# Altium schematic sheet Radio.SchDoc
size A4
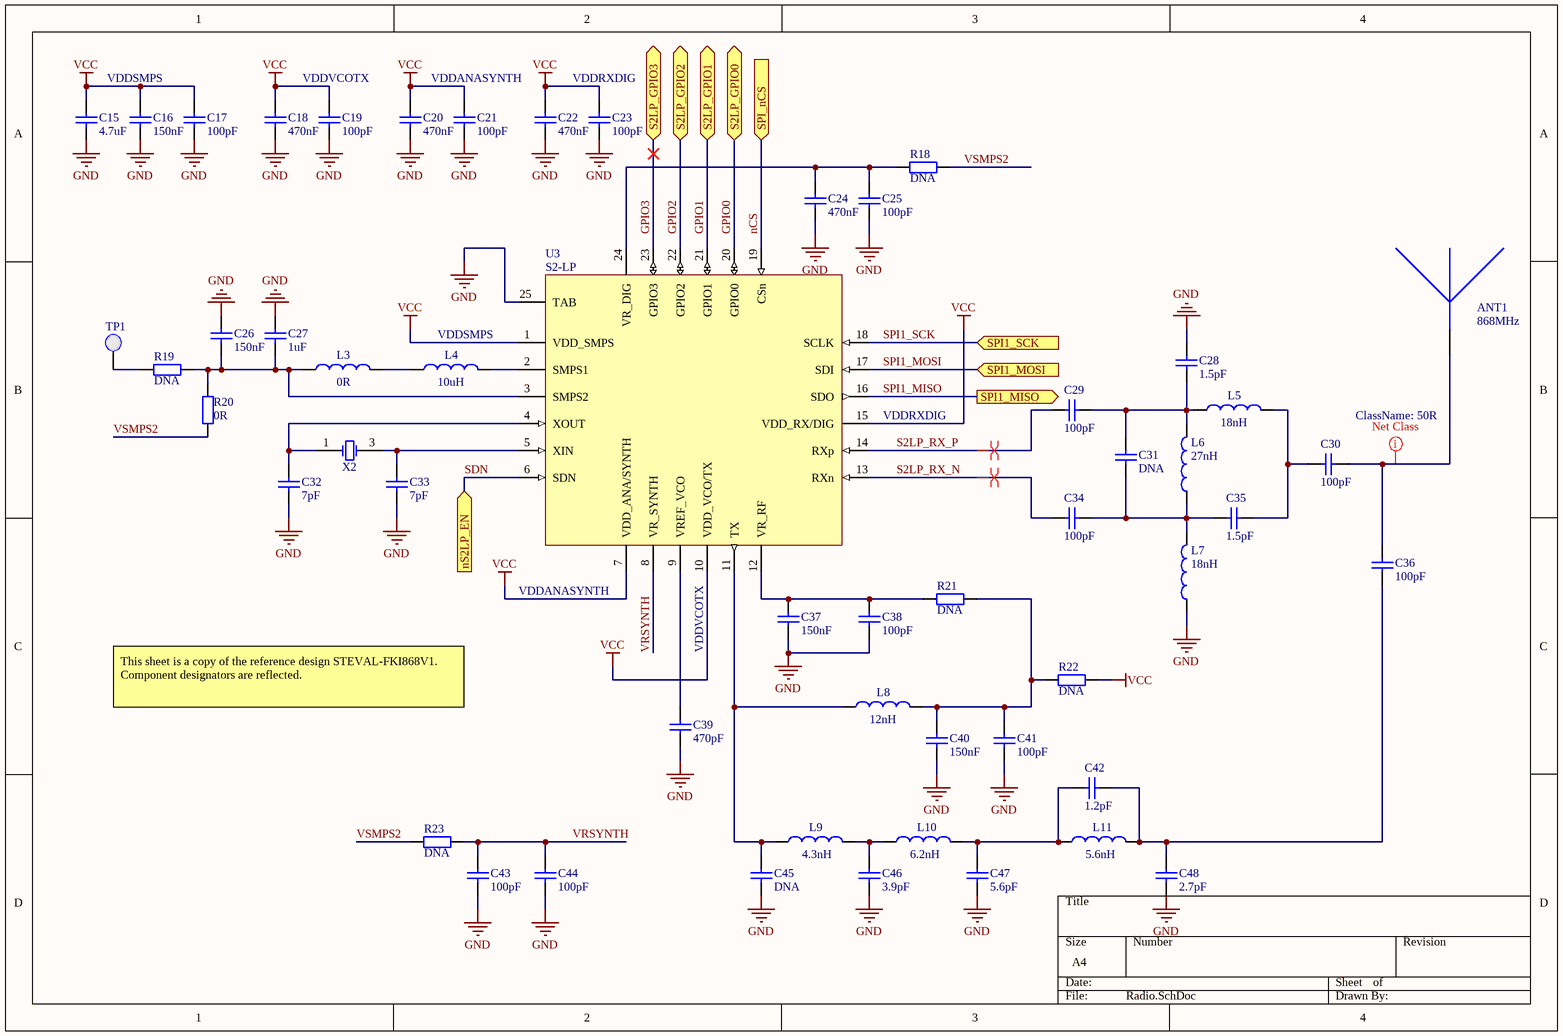
[diagram p0: Radio.SchDoc]

## Parts
ANT1  868MHz  [ANTENNA]
C15  4.7uF  [C0603]
C16  150nF  [C0402]
C17  100pF  [C0402]
C18  470nF  [C0402]
C19  100pF  [C0402]
C20  470nF  [C0402]
C21  100pF  [C0402]
C22  470nF  [C0402]
C23  100pF  [C0402]
C24  470nF  [C0402]
C25  100pF  [C0402]
C26  150nF  [C0402]
C27  1uF  [C0603]
C28  1.5pF  [C0402]
C29  100pF  [C0402]
C30  100pF  [C0402]
C31  DNA
C32  7pF  [C0805]
C33  7pF  [C0805]
C34  100pF  [C0402]
C35  1.5pF  [C0402]
C36  100pF  [C0402]
C37  150nF  [C0402]
C38  100pF  [C0402]
C39  470pF  [C0402]
C40  150nF  [C0402]
C41  100pF  [C0402]
C42  1.2pF  [C0402]
C43  100pF  [C0402]
C44  100pF  [C0402]
C45  DNA  [C0402]
C46  3.9pF  [C0402]
C47  5.6pF  [C0402]
C48  2.7pF  [C0402]
L3  0R  [R0402]
L4  Inductance: 10uH  [R0805]  (hidden comment: IND)
L5  Inductance: 18nH  [R0603]  (hidden comment: IND)
L6  Inductance: 27nH  [R0603]  (hidden comment: IND)
L7  Inductance: 18nH  [R0603]  (hidden comment: IND)
L8  Inductance: 12nH  [R0603]  (hidden comment: IND)
L9  Inductance: 4.3nH  [R0402]  (hidden comment: IND)
L10  Inductance: 6.2nH  [R0402]  (hidden comment: IND)
L11  Inductance: 5.6nH  [R0805]  (hidden comment: IND)
R18  DNA  [R0402]
R19  DNA  [R0402]
R20  0R  [R0402]
R21  DNA  [R0402]
R22  DNA  [R0402]
R23  DNA  [R0402]
TP1  TP_1mm  [TP_1mm]  (value not drawn)  (no BOM)
U3  S2-LP  [ST_S2LP]
X2  50MHz  [ABRACON_ABMM2]  (value not drawn)

## Ports
nS2LP_EN (in), S2LP_GPIO0 (bidir), S2LP_GPIO1 (bidir), S2LP_GPIO2 (bidir), S2LP_GPIO3 (bidir), SPI1_MISO (out), SPI1_MOSI (in), SPI1_SCK (in), SPI_nCS (in)

## Nets
GND: C15.1 C16.1 C17.1 C18.1 C19.1 C20.1 C21.1 C22.1 C23.1 C24.1 C25.1 C26.2 C27.2 C28.1 C32.1 C33.1 C37.1 C38.1 C39.1 C40.1 C41.1 C43.1 C44.1 C45.1 C46.1 C47.1 C48.1 L7.2 U3.25(TAB)
VCC: C15.2 C16.2 C17.2 C18.2 C19.2 C20.2 C21.2 C22.2 C23.2 R22.2 U3.1(VDD_SMPS) U3.7(VDD_ANA/SYNTH) U3.10(VDD_VCO/TX) U3.15(VDD_RX/DIG)
GPIO0: U3.20(GPIO0) ; port S2LP_GPIO0
GPIO1: U3.21(GPIO1) ; port S2LP_GPIO1
GPIO2: U3.22(GPIO2) ; port S2LP_GPIO2
GPIO3: U3.23(GPIO3) ; port S2LP_GPIO3
nCS: U3.19(CSn) ; port SPI_nCS
S2LP_RX_N: C34.2 U3.13(RXn)
S2LP_RX_P: C29.2 U3.14(RXp)
SDN: U3.6(SDN) ; port nS2LP_EN
SPI1_MISO: U3.16(SDO) ; port SPI1_MISO
SPI1_MOSI: U3.17(SDI) ; port SPI1_MOSI
SPI1_SCK: U3.18(SCLK) ; port SPI1_SCK
VRSYNTH: C43.2 C44.2 R23.2 U3.8(VR_SYNTH)
VSMPS2: R18.2 R20.1 R23.1
NetANT1_1: ANT1.1(V+) C30.1 C36.2
NetC24_2: C24.2 C25.2 R18.1 U3.24(VR_DIG)
NetC26_1: C26.1 C27.1 L3.2 R19.2 R20.2 U3.3(SMPS2)
NetC28_2: C28.2 C29.1 C31.2 L5.2 L6.1
NetC30_2: C30.2 C35.1 L5.1
NetC31_1: C31.1 C34.1 C35.2 L6.2 L7.1
NetC32_2: C32.2 U3.4(XOUT) X2.1(OSC1)
NetC33_2: C33.2 U3.5(XIN) X2.3(OSC2)
NetC36_1: C36.1 C42.1 C48.2 L11.1
NetC37_2: C37.2 C38.2 R21.1 U3.12(VR_RF)
NetC39_2: C39.2 U3.9(VREF_VCO)
NetC40_2: C40.2 C41.2 L8.1 R21.2 R22.1
NetC42_2: C42.2 C47.2 L10.1 L11.2
NetC45_2: C45.2 L8.2 L9.2 U3.11(TX)
NetC46_2: C46.2 L9.1 L10.2
NetL3_1: L3.1 L4.2
NetL4_1: L4.1 U3.2(SMPS1)
NetR19_1: R19.1 TP1.1

## Layout directives
net class 50R: NetANT1_1
differential pair: S2LP_RX_N, S2LP_RX_P

## Notes on the sheet
- VDDSMPS
- VDDVCOTX
- VDDANASYNTH
- VDDRXDIG
- (near L4) VDDSMPS
- (near U3) VDDRXDIG
- (near U3) VDDANASYNTH
- This sheet is a copy of the reference design STEVAL-FKI868V1. Component designators are reflected.

## Library data of the parts
ANT1 = ANTENNA
C15 = CAP: Manufacturer: MURATA; Manufacturer Part Number: GRM188R60J475KE19
C16 C26 C37 C40 = CAP: Manufacturer: MURATA; Manufacturer Part Number: GRM155R61A154KE19
C17 C19 C21 C23 C25 C29 C30 C34 C36 C38 C41 C43 C44 = CAP: Manufacturer: MURATA; Manufacturer Part Number: GRM1555C1H101JA01D
C18 C20 C22 C24 = CAP: Manufacturer: MURATA; Manufacturer Part Number: GRM155R61A474KE15
C27 = CAP: Manufacturer: MURATA; Manufacturer Part Number: GRM188R60J105KA01D
C28 C35 = CAP: Manufacturer: MURATA; Manufacturer Part Number: GRM1555C1H1R5CA01D
C31 C45 = CAP
C32 C33 = CAP: Manufacturer: Yageo; Manufacturer Part Number: CC0805DRNPO9BN7R0
C39 = CAP: Manufacturer: Murata; Manufacturer Part Number: GRM1555C1H471JA01
C42 = CAP: Manufacturer: MURATA; Manufacturer Part Number: GRM1555C1H1R2CA01D
C46 = CAP: Manufacturer: MURATA; Manufacturer Part Number: GRM1555C1H3R9CA01D
C47 = CAP: Manufacturer: MURATA; Manufacturer Part Number: GRM1555C1H5R6CA01D
C48 = CAP: Manufacturer: MURATA; Manufacturer Part Number: GRM1555C1H2R7BA01D
L3 = IND: Manufacturer: TE Connectivity; Manufacturer Part Number: CRG0402ZR
L4 = IND: Manufacturer: MURATA; Manufacturer Part Number: LQM21FN100M70L
L5 L7 = IND: Manufacturer: MURATA; Manufacturer Part Number: LQG15HS18NJ02D
L6 = IND: Manufacturer: MURATA; Manufacturer Part Number: LQG15HS27NJ02D
L8 = IND: Manufacturer: MURATA; Manufacturer Part Number: LQG18HN12NJ00D
L9 = IND: Manufacturer: MURATA; Manufacturer Part Number: LQG15HS4N3S02D
L10 = IND: Manufacturer: MURATA; Manufacturer Part Number: LQG15HN6N2S02D
L11 = IND: Manufacturer: MURATA; Manufacturer Part Number: LQW2BAS5N6J00L
R18 R19 R21-R23 = RES: Footprint: *
R20 = RES: Manufacturer: TE Connectivity; Manufacturer Part  Number: CRG0402ZR
U3 = ST_S2-LP: Manufacturer: ST Microelectronics; Manufacturer Part Number: S2-LP
X2 = OSC: Crystal Oscillator; Manufacturer: ABRACON; Manufacturer Part Number: ABMM2-50.000MHZ-E2F-T